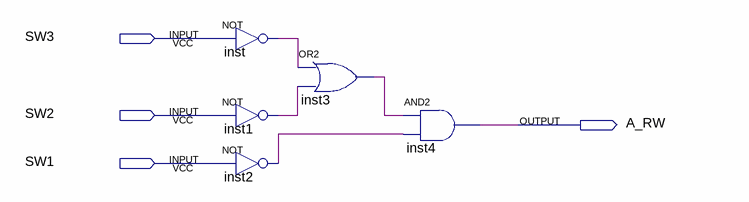
[diagram p0: schematic sheet]
// Quartus schematic a_rw.bdf as structural Verilog: 5 symbols, 4 pins
module a_rw (
  input  SW3,
  input  SW2,
  input  SW1,
  output A_RW
);

  wire inst1_out, inst2_out, inst3_out, inst_out;

  not inst (inst_out, SW3);
  not inst1 (inst1_out, SW2);
  not inst2 (inst2_out, SW1);
  or inst3 (inst3_out, inst_out, inst1_out);
  and inst4 (A_RW, inst3_out, inst2_out);
endmodule
